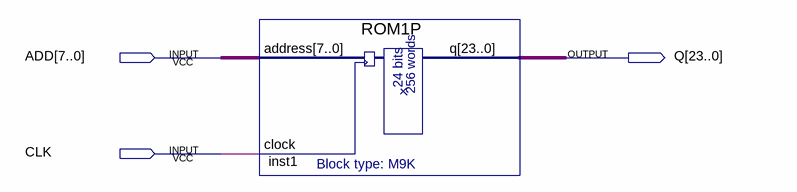
[diagram p0: schematic sheet]
// Quartus schematic ROM.bdf as structural Verilog: 1 symbols, 3 pins
module ROM (
  input  [7:0] ADD,
  input  CLK,
  output [23:0] Q
);

  ROM1P inst1 (.address(ADD), .clock(CLK), .q(Q));
endmodule
